# EAGLE schematic DCS (EAGLE 6.2)

## Sheet 1 of 2: Main
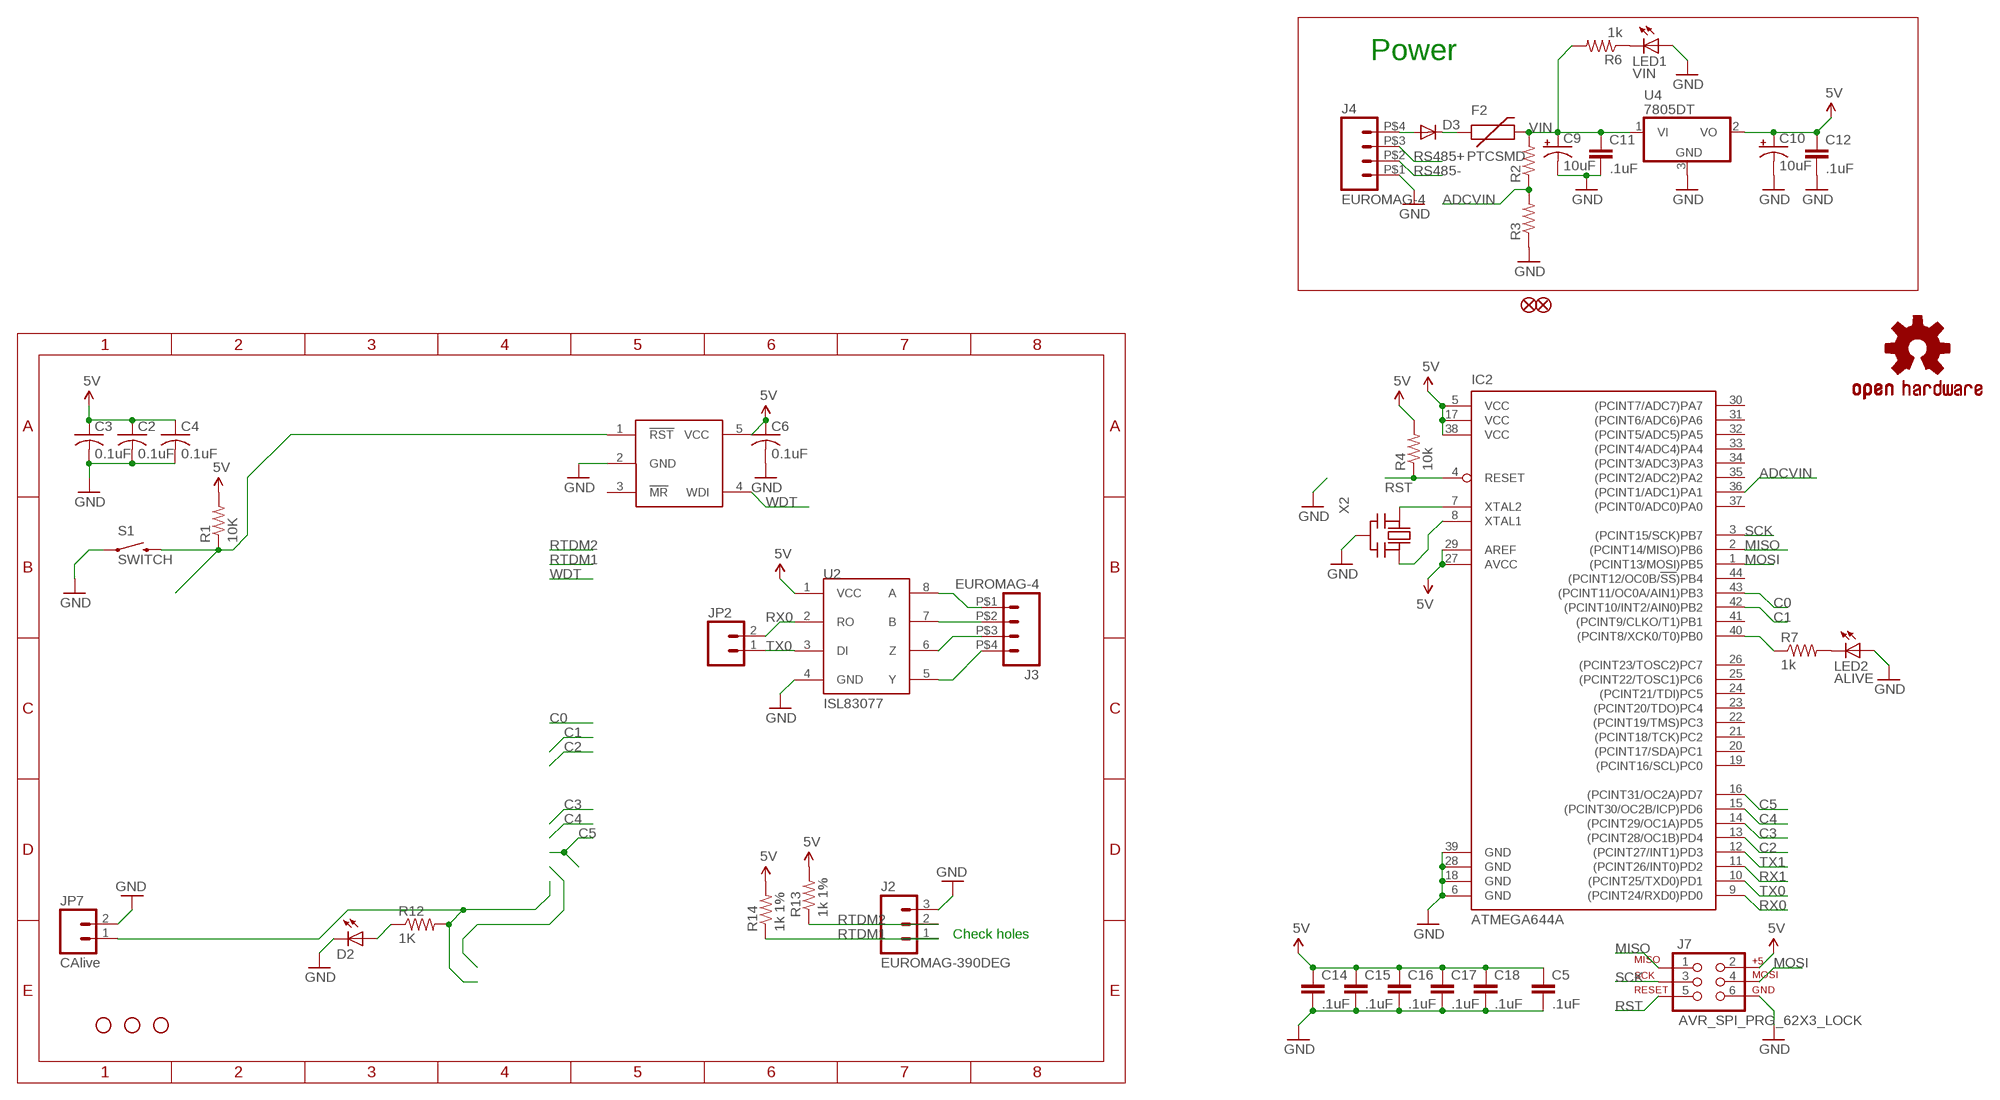
[diagram p0: schematic, sheet 1]

### Parts
C2  0.1uF  C-USC0805  [C0805]
C3  0.1uF  C-USC0805  [C0805]
C4  0.1uF  C-USC0805  [C0805]
C5  .1uF  CAP0805  [0805]
C6  0.1uF  C-USC0805  [C0805]
C9  10uF  CAP_POL6032  [EIA6032]
C10  10uF  CAP_POL1206-KIT  [EIA3216-KIT]
C11  .1uF  CAP0805  [0805]
C12  .1uF  CAP0805  [0805]
C14  .1uF  CAP0805  [0805]
C15  .1uF  CAP0805  [0805]
C16  .1uF  CAP0805  [0805]
C17  .1uF  CAP0805  [0805]
C18  .1uF  CAP0805  [0805]
D2  LEDCHIPLED_0805  [CHIPLED_0805]
D3  DIODESMA  [SMA-DIODE]
F2  PTCSMD  [PTC-1206]
IC2  ATMEGA644A  [TQFP44]
J2  EUROMAG-390DEG  [M3]
J3  EUROMAG-4  [M4]
J4  EUROMAG-4  [M4]
J7  AVR_SPI_PRG_62X3_LOCK  [2X3_LOCK]
JP1  STAND-OFF  [STAND-OFF]
JP2  M02LOCK  [1X02_LOCK]
JP3  STAND-OFF  [STAND-OFF]
JP4  STAND-OFF  [STAND-OFF]
JP5  FIDUCIAL1.5X3  [FIDUCIAL-1.5X3]
JP7  CAlive  M02POLAR_LOCK  [MOLEX-1X2_LOCK]
JP8  FIDUCIAL1.5X3  [FIDUCIAL-1.5X3]
LED1  VIN  LED0603  [LED-0603]
LED2  ALIVE  LED0603  [LED-0603]
R1  10K  R-US_M0805  [M0805]
R2  RESISTOR0805-RES  [0805]
R3  RESISTOR0805-RES  [0805]
R4  10k  RESISTOR0805-RES  [0805]
R6  1k  RESISTOR0805-RES  [0805]
R7  1k  RESISTOR0805-RES  [0805]
R12  1K  R-US_M0805  [M0805]
R13  1k 1%  R-US_M0805  [M0805]
R14  1k 1%  R-US_M0805  [M0805]
S1  SWITCH  SWITCH-MOMENTARY-2PTH  [TACTILE-PTH]
U2  ISL83077  [SO08]
U3  MAX823  [SOT23-5L]
U4  7805DT  [TO252]
U$6  OSHW-LOGOL  [OSHW-LOGO-L]
X2  CERMOSCILL-AWCSR  [AWCSR]

### Nets
5V: C2.1 C3.1 C4.1 C5.1 C6.1 C10.A(+) C12.1 C14.1 C15.1 C16.1 C17.1 C18.1 IC2.5(VCC) IC2.17(VCC) IC2.27(AVCC) IC2.29(AREF) IC2.38(VCC) J7.2 R1.2 R4.2 R13.2 R14.2 U2.1(VCC) U3.5(VCC) U4.2(VO) ; also sheet 2
ADCVIN: IC2.36((PCINT1/ADC1)PA1) R2.1 R3.2
C0: IC2.43((PCINT11/OC0A/AIN1)PB3) ; also sheet 2
C1: IC2.42((PCINT10/INT2/AIN0)PB2) ; also sheet 2
C2: IC2.13((PCINT28/OC1B)PD4) ; also sheet 2
C3: IC2.14((PCINT29/OC1A)PD5) ; also sheet 2
C4: IC2.15((PCINT30/OC2B/ICP)PD6) ; also sheet 2
C5: IC2.16((PCINT31/OC2A)PD7) ; also sheet 2
GND: C2.2 C3.2 C4.2 C5.2 C6.2 C9.P$2(-) C10.C(-) C11.2 C12.2 C14.2 C15.2 C16.2 C17.2 C18.2 D2.C IC2.6(GND) IC2.18(GND) IC2.28(GND) IC2.39(GND) J2.3 J4.P$1 J7.6 JP7.2 LED1.A LED2.A R3.1 S1.1 U2.4(GND) U3.2(GND) U4.3(GND) X2.2(GND) ; also sheet 2
MISO: IC2.2((PCINT14/MISO)PB6) J7.1
MOSI: IC2.1((PCINT13/MOSI)PB5) J7.4
N$4: R1.1 S1.3 U3.1(!RST)
N$6: J3.P$1 U2.8(A)
N$10: D2.A R12.1
N$11: J3.P$2 U2.7(B)
N$12: J3.P$3 U2.6(Z)
N$15: J3.P$4 U2.5(Y)
N$17: D3.A J4.P$4
N$18: D3.C F2.1
N$20: LED1.C R6.1
N$21: LED2.C R7.2
N$23: IC2.40((PCINT8/XCK0/T0)PB0) R7.1
N$26: IC2.7(XTAL2) X2.1(IN)
N$27: IC2.8(XTAL1) X2.3(OUT)
RS485+: J4.P$3
RS485-: J4.P$2
RST: IC2.4(RESET) J7.5 R4.1
RTDM1: J2.1 R14.1
RTDM2: J2.2 R13.1
RX0: IC2.9((PCINT24/RXD0)PD0) JP2.2 U2.2(RO)
RX1: IC2.11((PCINT26/INT0)PD2) ; also sheet 2
SCK: IC2.3((PCINT15/SCK)PB7) J7.3
SCLK: JP7.1 R12.2
TX0: IC2.10((PCINT25/TXD0)PD1) JP2.1 U2.3(DI)
TX1: IC2.12((PCINT27/INT1)PD3) ; also sheet 2
VIN: C9.P$1(+) C11.1 F2.2 R2.2 R6.2 U4.1(VI)
WDT: U3.4(WDI)
Unconnected: IC2.19((PCINT16/SCL)PC0) IC2.20((PCINT17/SDA)PC1) IC2.21((PCINT18/TCK)PC2) IC2.22((PCINT19/TMS)PC3) IC2.23((PCINT20/TDO)PC4) IC2.24((PCINT21/TDI)PC5) IC2.25((PCINT22/TOSC1)PC6) IC2.26((PCINT23/TOSC2)PC7) IC2.30((PCINT7/ADC7)PA7) IC2.31((PCINT6/ADC6)PA6) IC2.32((PCINT5/ADC5)PA5) IC2.33((PCINT4/ADC4)PA4) IC2.34((PCINT3/ADC3)PA3) IC2.35((PCINT2/ADC2)PA2) IC2.37((PCINT0/ADC0)PA0) IC2.41((PCINT9/CLKO/T1)PB1) IC2.44((PCINT12/OC0B/!SS!)PB4) U3.3(!MR)

### Notes on the sheet
- Power
- Check holes

## Sheet 2 of 2: PWM
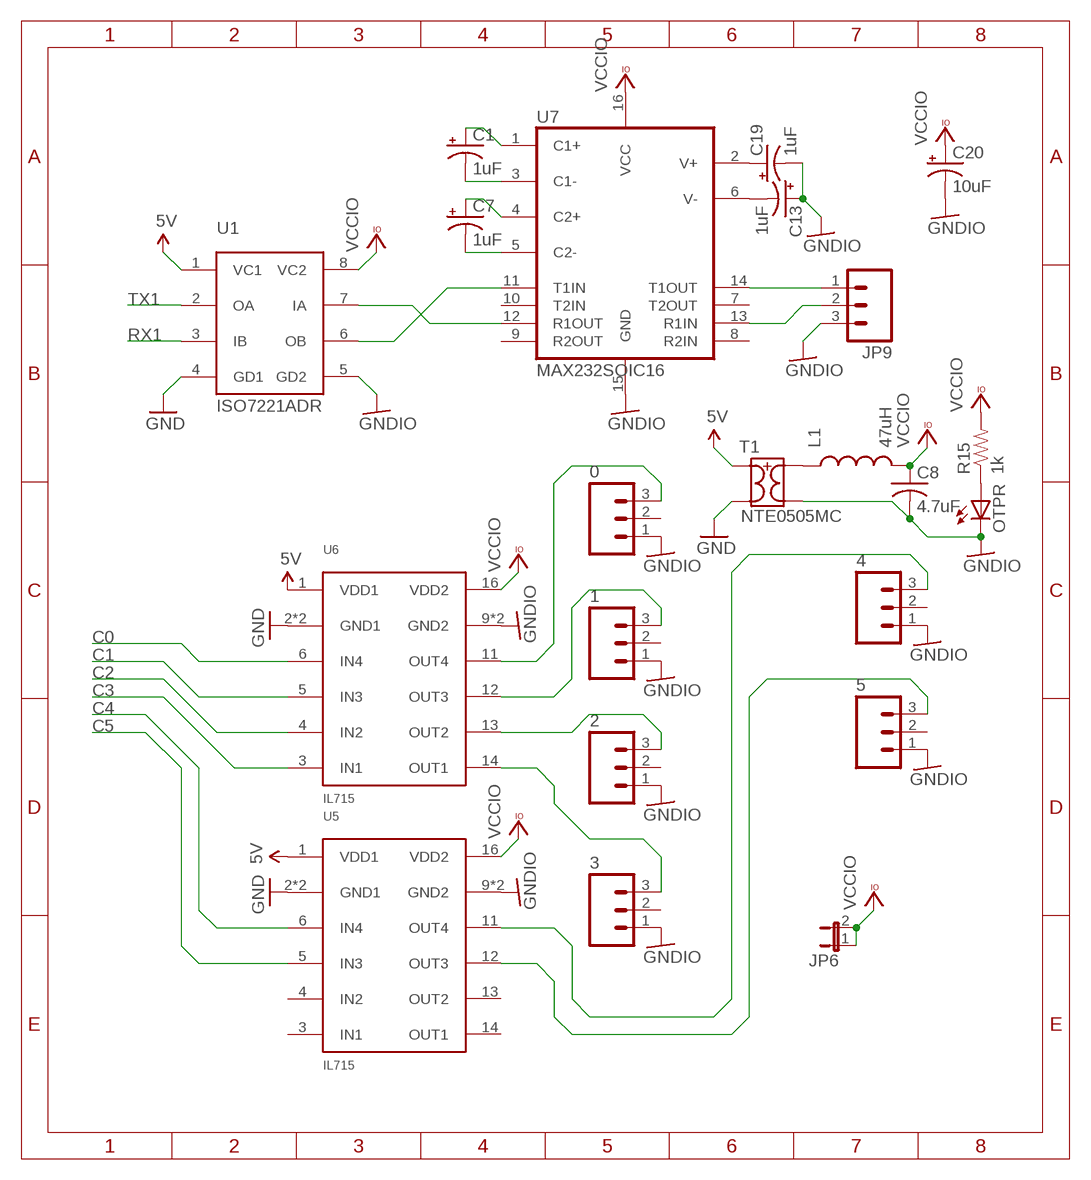
[diagram p1: schematic, sheet 2]

### Parts
0  M03PTH  [1X03]
1  M03PTH  [1X03]
2  M03PTH  [1X03]
3  M03PTH  [1X03]
4  M03PTH  [1X03]
5  M03PTH  [1X03]
C1  1uF  CAP_POL1206  [EIA3216]
C7  1uF  CAP_POL1206  [EIA3216]
C8  4.7uF  C-USC0805  [C0805]
C13  1uF  CAP_POL1206  [EIA3216]
C19  1uF  CAP_POL1206  [EIA3216]
C20  10uF  CAP_POL1206  [EIA3216]
JP6  JUMPER-2SMD-NO  [SJ_2S-NO]
JP9  M03LOCK  [1X03_LOCK]
L1  47uH  INDUCTOR1  [0805]
OTPR  LEDCHIP-LED0805  [CHIP-LED0805]
R15  1k  RESISTOR0805-RES  [0805]
T1  NTE0505MC  [SO-8FT]
U1  ISO7221ADR  [SO08]
U5  IL715  [S016]
U6  IL715  [S016]
U7  MAX232SOIC16  [SO016]

### Nets
5V: T1.3 U1.1(VC1) U5.1(VDD1) U6.1(VDD1) ; also sheet 1
C0: U6.6(IN4) ; also sheet 1
C1: U6.5(IN3) ; also sheet 1
C2: U6.4(IN2) ; also sheet 1
C3: U6.3(IN1) ; also sheet 1
C4: U5.6(IN4) ; also sheet 1
C5: U5.5(IN3) ; also sheet 1
GND: T1.1 U1.4(GD1) U5.2(GND1) U5.8(GND1) U6.2(GND1) U6.8(GND1) ; also sheet 1
GNDIO: 0.1 1.1 2.1 3.1 4.1 5.1 C8.2 C13.A(+) C19.C(-) C20.C(-) JP9.3 OTPR.C T1.7 U1.5(GD2) U5.9(GND2) U5.15(GND2) U6.9(GND2) U6.15(GND2) U7.15(GND)
N$2: C19.A(+) U7.2(V+)
N$5: C13.C(-) U7.6(V-)
N$8: C7.A(+) U7.4(C2+)
N$9: C7.C(-) U7.5(C2-)
N$13: C1.C(-) U7.3(C1-)
N$14: OTPR.A R15.1
N$16: L1.1 T1.8
N$19: C1.A(+) U7.1(C1+)
N$22: JP9.1 U7.14(T1OUT)
N$24: JP9.2 U7.13(R1IN)
N$28: U1.6(OB) U7.11(T1IN)
N$29: U1.7(IA) U7.12(R1OUT)
N$32: 0.3 U6.11(OUT4)
N$33: 2.3 U6.13(OUT2)
N$35: 3.3 U6.14(OUT1)
N$36: 4.3 U5.11(OUT4)
N$37: 5.3 U5.12(OUT3)
N$38: 1.3 U6.12(OUT3)
RX1: U1.3(IB) ; also sheet 1
TX1: U1.2(OA) ; also sheet 1
VCCIO: C8.1 C20.A(+) JP6.1 JP6.2 L1.2 R15.2 U1.8(VC2) U5.16(VDD2) U6.16(VDD2) U7.16(VCC)
Unconnected: 0.2 1.2 2.2 3.2 4.2 5.2 U5.3(IN1) U5.4(IN2) U5.13(OUT2) U5.14(OUT1) U7.7(T2OUT) U7.8(R2IN) U7.9(R2OUT) U7.10(T2IN)

## Library data of the parts
0 1-5 JP9 = SparkFun:M03: Header 3 Standard 3-pin 0.1" header. Use with straight break away headers (SKU : PRT-00116), right angle break away headers (PRT-00553), swiss pins (PRT-00743), machine pins (PRT-00117), and female headers (PRT-00115). Molex polarized connector foot print use with SKU : PRT-08232 with associated crimp pins and housings.
C1 C7 C9 C10 C13 C19 C20 = SparkFun:CAP_POL: Capacitor Polarized These are standard SMD and PTH capacitors. Normally 10uF, 47uF, and 100uF in electrolytic and tantalum varieties. Always verify the external diameter of the through hole cap, it varies with capacity, voltage, and manufacturer. The EIA devices should be standard.
C2-C4 C6 C8 = adafruit:C-US: CAPACITOR, American symbol
C5 C11 C12 C14-C18 = SparkFun:CAP: Capacitor Standard 0603 ceramic capacitor, and 0.1" leaded capacitor.
D2 OTPR = adafruit:LED: LED OSRAM: - CHIPLED LG R971, LG N971, LY N971, LG Q971, LY Q971, LO R971, LY R971 LH N974, LH R974 LS Q976, LO Q976, LY Q976 LO Q996 - Hyper CHIPLED LW Q18S LB Q993, LB Q99A, LB R99A - SideLED LS A670, LO A670, LY A670, LG A670, LP A670 LB A673, LV A673, LT A673, LW A673 LH A674 LY A675 LS A676, LA A676, LO A676, LY A676, LW A676 LS A679, LY A679, LG A679 - Hyper Micro SIDELED® LS Y876, LA Y876, LO Y876, LY Y876 LT Y87S - SmartLED LW L88C, LW L88S LB L89C, LB L89S, LG L890 LS L89K, LO L89K, LY L89K LS L896, LA L896, LO L896, LY L896 - TOPLED LS T670, LO T670, LY T670, LG T670, LP T670 LSG T670, LSP T670, LSY T670, LOP T670, LYG T670 LG T671, LOG T671, LSG T671 LB T673, LV T673, LT T673, LW T673 LH T674 LS T676, LA T676, LO T676, LY T676, LB T676, LH T676, LSB T676, LW T676 LB T67C, LV T67C, LT T67C, LS T67K, LO T67K, LY T67K, LW E67C LS E67B, LA E67B, LO E67B, LY E67B, LB E67C, LV E67C, LT E67C LW T67C LS T679, LY T679, LG T679 LS T770, LO T770, LY T770, LG T770, LP T770 LB T773, LV T773, LT T773, LW T773 LH T774 LS E675, LA E675, LY E675, LS T675 LS T776, LA T776, LO T776, LY T776, LB T776 LHGB T686 LT T68C, LB T68C - Hyper Mini TOPLED® LB M676 - Mini TOPLED Santana® LG M470 LS M47K, LO M47K, LY M47K Source: http://www.osram.convergy.de/
D3 = SparkFun:DIODE: Diode These are standard reverse protection diodes and small signal diodes. SMA package can handle up to about 1A. SOD-323 can handle about 200mA. What the SOD-323 package when ordering, there are some mfgs out there that are 5-pin packages.
F2 = SparkFun:PTC: Resettable Fuse PTC Resettable Fuse. Spark Fun Electronics SKU : COM-08357
IC2 = atmel:ATMEGA644: 8-bit Microcontroller with 64K Bytes In-System Programmable Flash Source: http://www.atmel.com/dyn/resources/prod_documents/doc2593.pdf; MPN: ATMEGA644PV-10AU; OC_FARNELL: 1455123; OC_NEWARK: 58M3748
J2 = NASA_LIB:EUROMAG-3
J3 J4 = NASA_LIB:EUROMAG-4
J7 = SparkFun:AVR_SPI_PRG_6: AVR ISP 6 Pin This is the reduced ISP connector for AVR programming. Common on Arduino. This footprint will take up less PCB space and can be used with a 10-pin to 6-pin adapter such as SKU: BOB-08508
JP1 JP3 JP4 = SparkFun:STAND-OFF: Stand Off This is the mechanical footprint for a #4 phillips button head screw. Use the keepout ring to avoid running the screw head into surrounding components. SKU : PRT-00447
JP2 JP7 = SparkFun:M02: Header 2 Standard 2-pin 0.1" header. Use with straight break away headers (SKU : PRT-00116), right angle break away headers (PRT-00553), swiss pins (PRT-00743), machine pins (PRT-00117), and female headers (PRT-00115). Molex polarized connector foot print use with SKU : PRT-08233 with associated crimp pins and housings.
JP5 JP8 = SparkFun:FIDUCIAL: Fiducial Alignment Points Various fiducial points for machine vision alignment.
JP6 = SparkFun:JUMPER-2: Jumper Basic 0.1" spaced jumper. Use with breakaway headers.
L1 = NASA_LIB:INDUCTOR
LED1 LED2 = SparkFun:LED: LEDs Standard schematic elements and footprints for 5mm, 3mm, 1206, and 0603 sized LEDs. 5mm - Spark Fun Electronics SKU : COM-00529 (and others)
R1 R12-R14 = adafruit:R-US_: RESISTOR, American symbol
R2-R4 R6 R7 R15 = SparkFun:RESISTOR: Resistor Basic schematic elements and footprints for 0603, 1206, and PTH resistors.
S1 = SparkFun:SWITCH-MOMENTARY-2
T1 = EmEndev:NTE0505MC
U1 = NASA_LIB:ISO7221ADR
U2 = NASA_LIB:ISL83077
U3 = NASA_LIB:MAX823
U4 = adafruit:78*: Positive VOLTAGE REGULATOR Added bigger pads to the TO-92 package
U5 U6 = NASA_LIB:IL715
U7 = SparkFun:MAX232: RS232 Transceiver Very common IC. This is generically called 'MAX232', but works with the 3V equivalent MAX3232 generic ICs. Field tested and mother approved. Spark Fun Electronics SKU : COM-00316 (DIP) and COM-00589 (SMD)
U$6 = SparkFun:OSHW-LOGO: Open Source Hardware Logo This logo indicates the piece of hardware it is found on incorporates a OSHW license and/or adheres to the definition of open source hardware found here: http://freedomdefined.org/OSHW
X2 = adafruit:CERMOSCILL: Ceramic oscillator with built in capacitors such as ZTT-12MHz http://www.ladyada.net/library/eagle

## Net classes
1 power: width 0.61 mm, drill 0.711 mm, clearance 0.203 mm